# EasyEDA schematic 1-Schematic_P3_LedDimmer.json
TITLE: P3_LED_Dimmer; REV: 1.0; Date: 2019-07-21; Sheet: 1/1; Drawn By: Francisco Moreno; Company: Universidad de Sevilla
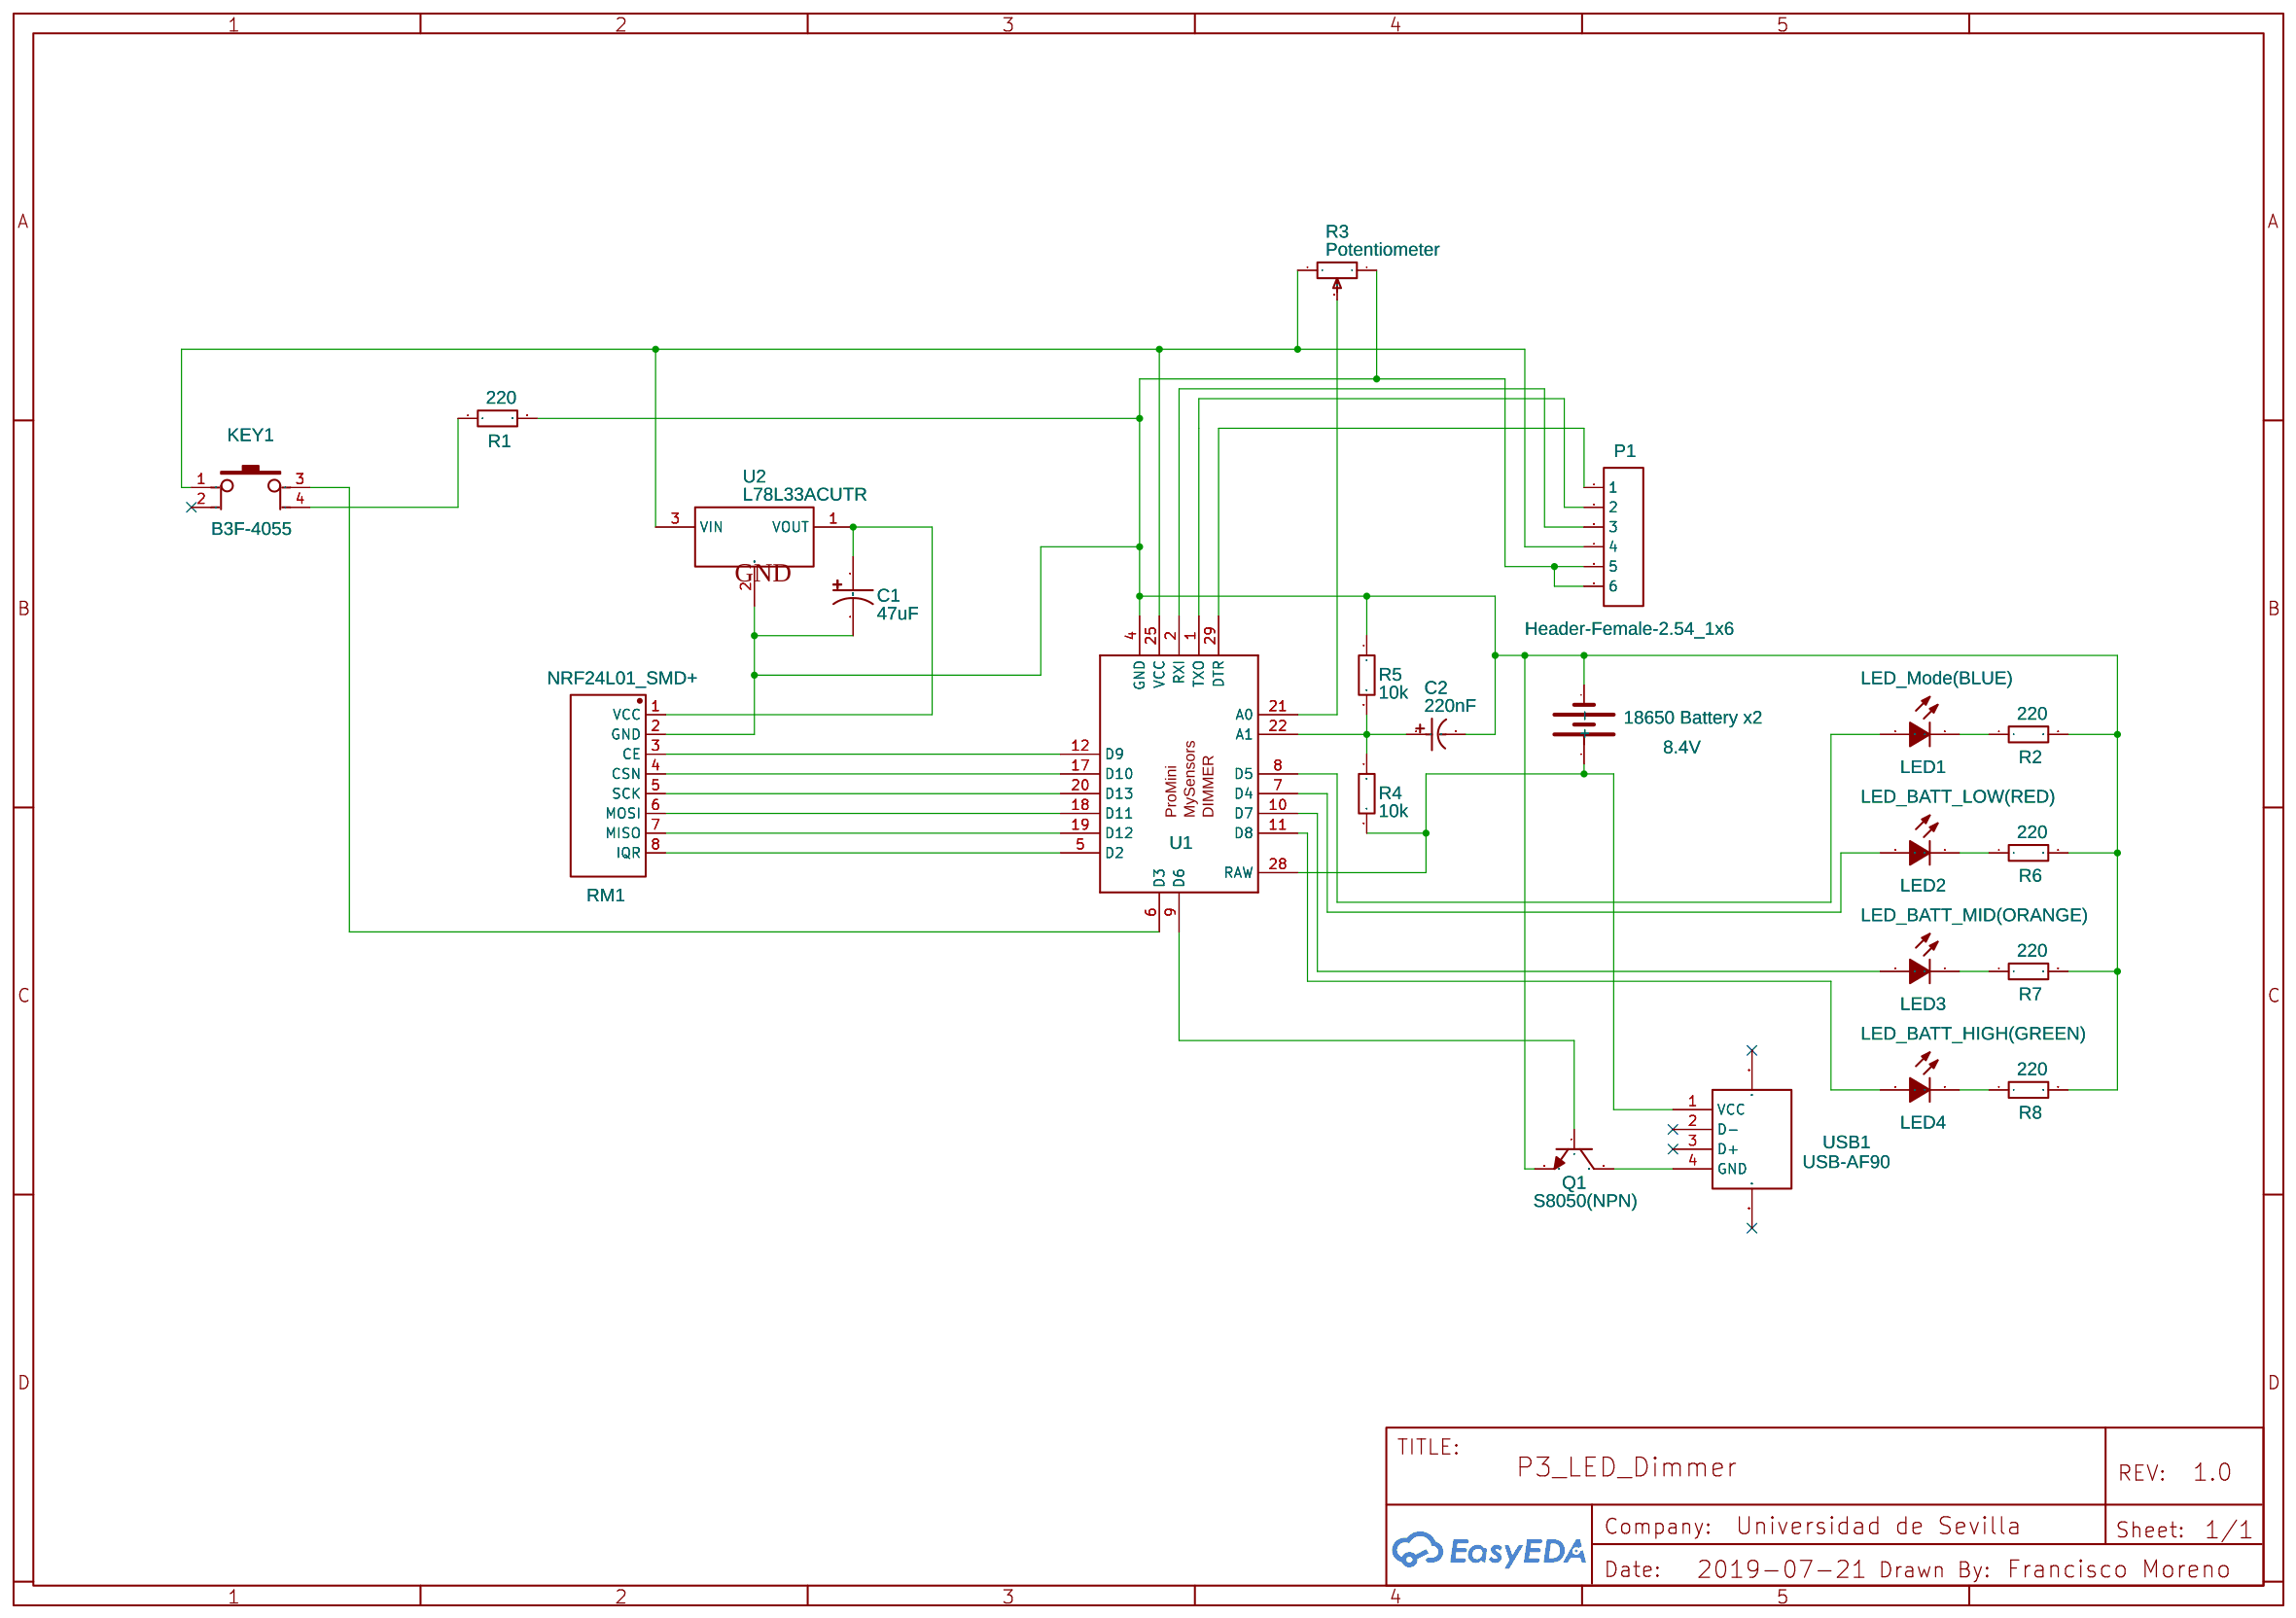
[diagram p0: schematic sheet]

## Parts
8.4V  18650 Battery x2  [18650-HOLDERX2]
C1  47uF  [SMD,6.3X5.4MM]
C2  220nF  [CAP-D5.0XF2.0]
KEY1  B3F-4055  [KEY-12*12_EDIT]
LED1  LED_Mode(BLUE)  [LED-DIP-4.0MM]
LED2  LED_BATT_LOW(RED)  [LED-DIP-4.0MM]
LED3  LED_BATT_MID(ORANGE)  [LED-DIP-4.0MM]
LED4  LED_BATT_HIGH(GREEN)  [LED-DIP-4.0MM]
P1  Header-Female-2.54_1x6  [HDR-6X1/2.54]
Q1  S8050(NPN)  [SOT-23(SOT-23-3)]
R1  220  [1206]
R2  220  [1206]
R3  Potentiometer  [RES-ADJ-TH_3PIN-V-L10.00-W10.40-PITCH5.00-FS]
R4  10k  [1206]
R5  10k  [1206]
R6  220  [1206]
R7  220  [1206]
R8  220  [1206]
RM1  NRF24L01_SMD+  [NRF24L01_SMD+]
U1  ArduinoProMini - MySensors(DIMMER)  [PROMINI_MYSENSORS_PINS(DIMMER)]
U2  L78L33ACUTR  [SOT-89]
USB1  USB-AF90  [USB-A_4PIN-FEMALE-AF90_MH-PITCH14.00]

## Library data of the parts
8.4V = -: Battery Holder; Contributor: framortej; Manufacturer Part: ?
C1 = RT1V470M0605: Supplier: LCSC; Supplier Part: C267463; Manufacturer: ROQANG; Contributor: LCSC
C2 = 0.22uF 50V 5*11: Supplier: LCSC; Manufacturer: ValuePro; Supplier Part: C45096
KEY1 = -: Supplier: LCSC; Manufacturer: OMRON; Supplier Part: C84931; Contributor: framortej
LED1 = -: Supplier: LCSC; Supplier Part: C330750; Manufacturer: TOGIALED; Manufacturer Part: TJ-L3FYTGCBMCGLFLC6B-A5; Contributor: LCSC
LED2 = -: Supplier: LCSC; Supplier Part: C331035; Manufacturer: TOGIALED; Manufacturer Part: TJ-L3FYTGHRMTCSFLC3R-A5; Contributor: LCSC
LED3 = -: Supplier: LCSC; Supplier Part: C330775; Manufacturer: TOGIALED; Manufacturer Part: TJ-L3FYTGHYMCGLFLC9Y-A5; Contributor: LCSC
LED4 = -: Supplier: LCSC; Supplier Part: C330740; Manufacturer: TOGIALED; Manufacturer Part: TJ-L5FYTGHKMCGLFLC7K-A5; Contributor: LCSC
P1 = -: Supplier: LCSC; Manufacturer: BOOMELE; Manufacturer Part: Female header 1*6p; Supplier Part: C40877
Q1 = -: Supplier: LCSC; Manufacturer: Semtech; Manufacturer Part: MMBT8050D 1.5A(Y1); Contributor: LCSC; Supplier Part: C118742; LCSC Assembly: Yes; SMT Type: Extend
R1 R2 R6-R8 = 1206W4F2200T5E: Supplier: LCSC; Manufacturer: UniOhm; Supplier Part: C17957; LCSC Assembly: Yes; SMT Type: Extend
R3 = PT10LV10-103A2020: Supplier: LCSC; Supplier Part: C390097; Manufacturer: Amphenol Piher; Contributor: LCSC
R4 R5 = 1206W4F2200T5E: Supplier: LCSC; Manufacturer: FH; Manufacturer Part: RS-05K103JT; Supplier Part: C115295; LCSC Assembly: Yes; SMT Type: Extend
RM1 = -: Supplier: LCSC; Manufacturer Part: ?; Contributor: tiana
U1 = -: Manufacturer Part: New SchematicLib; Contributor: framortej; Link: https://robotdyn.ru/catalog/arduino/boards/promini_atmega328p_compatible_with_arduino_mini.html
U2 = -: Supplier: LCSC; Manufacturer: STMicroelectronics; image: //image.lceda.cn/szlcsc/C14170.jpg; Supplier Part: C14170; LCSC Assembly: Yes; SMT Type: Extend
USB1 = -: Supplier: LCSC; Manufacturer: ValuePro; Manufacturer Part: A/F90 PBT White plastic; image: //image.lceda.cn/szlcsc/C42647.jpg; Supplier Part: C42647

## Nets
Net-(8.4V-+): 8.4V.+ R4.2 U1.28(RAW) USB1.1(VCC)
Net-(8.4V--): 8.4V.- C1.2 C2.2 P1.5 P1.6 Q1.2 R1.2 R2.2 R3.A R5.1 R6.2 R7.2 R8.2 RM1.2(GND) U1.4(GND) U2.2(GND)
Net-(C1-1): C1.1 RM1.1(VCC) U2.1(VOUT)
Net-(C2-1): C2.1 R4.1 R5.2 U1.22(A1)
Net-(KEY1-1): KEY1.1 P1.4 R3.E U1.25(VCC) U2.3(VIN)
Net-(KEY1-3): KEY1.3 U1.6(D3)
Net-(KEY1-4): KEY1.4 R1.1
Net-(LED1-1): LED1.1(A) U1.8(D5)
Net-(LED1-2): LED1.2(C) R2.1
Net-(LED2-1): LED2.1(A) U1.7(D4)
Net-(LED2-2): LED2.2(C) R6.1
Net-(LED3-1): LED3.1(A) U1.10(D7)
Net-(LED3-2): LED3.2(C) R7.1
Net-(LED4-1): LED4.1(A) U1.11(D8)
Net-(LED4-2): LED4.2(C) R8.1
Net-(P1-1): P1.1 U1.29(DTR)
Net-(P1-2): P1.2 U1.1(TXO)
Net-(P1-3): P1.3 U1.2(RXI)
Net-(Q1-1): Q1.1 U1.9(D6)
Net-(Q1-3): Q1.3 USB1.4(GND)
Net-(R3-S): R3.S U1.21(A0)
Net-(RM1-3): RM1.3(CE) U1.12(D9)
Net-(RM1-4): RM1.4(CSN) U1.17(D10)
Net-(RM1-5): RM1.5(SCK) U1.20(D13)
Net-(RM1-6): RM1.6(MOSI) U1.18(D11)
Net-(RM1-7): RM1.7(MISO) U1.19(D12)
Net-(RM1-8): RM1.8(IQR) U1.5(D2)

Not connected (* = marked no-connect by the designer): KEY1 2*; USB1 2(D-)* 3(D+)* MH1* MH2*
